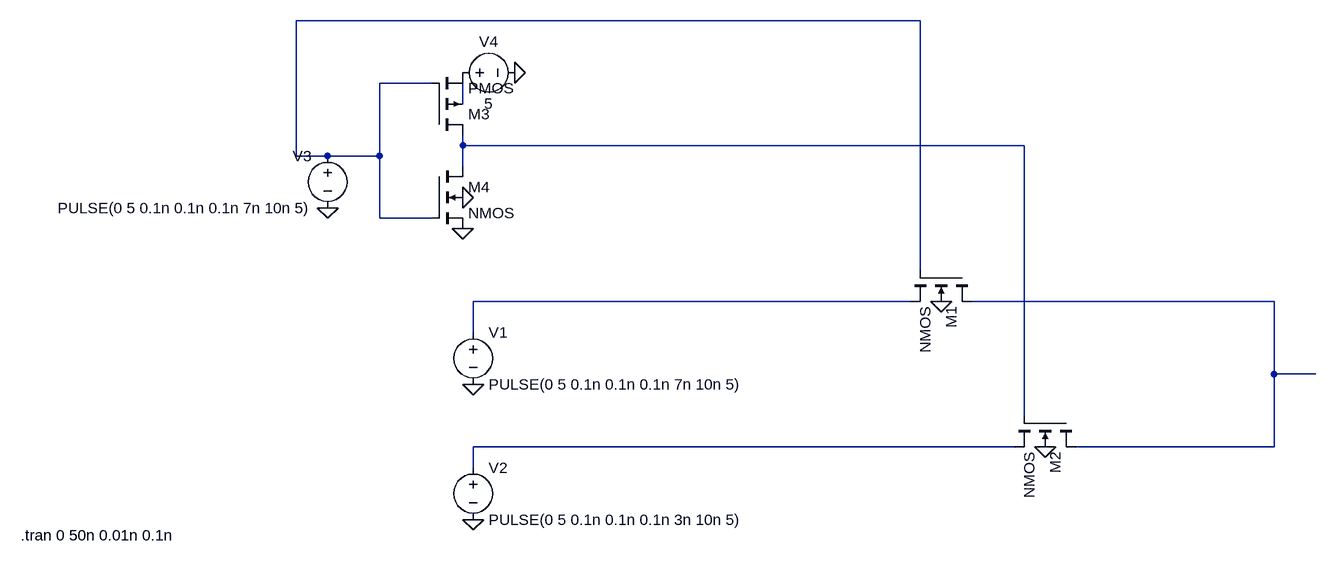
[diagram p0: schematic ptl.asc]
ptl.asc, the LTspice schematic file:
Version 4
SHEET 1 880 680
WIRE 176 -240 -784 -240
WIRE -576 -144 -656 -144
WIRE -528 -112 -528 -144
WIRE -528 -48 -528 -64
WIRE 336 -48 -528 -48
WIRE -784 -32 -784 -240
WIRE -736 -32 -784 -32
WIRE -656 -32 -656 -144
WIRE -656 -32 -736 -32
WIRE -528 -16 -528 -48
WIRE -656 64 -656 -32
WIRE -576 64 -656 64
WIRE 176 144 176 -240
WIRE 160 192 -512 192
WIRE 720 192 256 192
WIRE -512 240 -512 192
WIRE 720 304 720 192
WIRE 784 304 720 304
WIRE 336 368 336 -48
WIRE 320 416 -512 416
WIRE 720 416 720 304
WIRE 720 416 416 416
WIRE -512 448 -512 416
FLAG 208 192 0
FLAG 368 416 0
FLAG -512 528 0
FLAG -512 320 0
FLAG -528 80 0
FLAG -528 32 0
FLAG -448 -160 0
FLAG -736 48 0
SYMBOL voltage -512 224 R0
WINDOW 123 0 0 Left 2
WINDOW 39 0 0 Left 2
SYMATTR InstName V1
SYMATTR Value PULSE(0 5 0.1n 0.1n 0.1n 7n 10n 5)
SYMBOL voltage -512 432 R0
WINDOW 123 0 0 Left 2
WINDOW 39 0 0 Left 2
SYMATTR InstName V2
SYMATTR Value PULSE(0 5 0.1n 0.1n 0.1n 3n 10n 5)
SYMBOL nmos4 256 144 R90
SYMATTR InstName M1
SYMBOL nmos4 416 368 R90
SYMATTR InstName M2
SYMBOL pmos4 -576 -64 M180
SYMATTR InstName M3
SYMBOL nmos4 -576 -16 R0
SYMATTR InstName M4
SYMBOL voltage -544 -160 M90
WINDOW 0 -32 56 VBottom 2
WINDOW 3 32 56 VTop 2
WINDOW 123 0 0 Left 2
WINDOW 39 0 0 Left 2
SYMATTR InstName V4
SYMATTR Value 5
SYMBOL voltage -736 -48 M0
WINDOW 123 0 0 Left 2
WINDOW 39 0 0 Left 2
SYMATTR InstName V3
SYMATTR Value PULSE(0 5 0.1n 0.1n 0.1n 7n 10n 5)
TEXT -1208 552 Left 2 !.tran 0 50n 0.01n 0.1n

The netlist it stands for:
* ptl.asc
V1 N004 0 PULSE(0 5 0.1n 0.1n 0.1n 7n 10n 5)
V2 N006 0 PULSE(0 5 0.1n 0.1n 0.1n 3n 10n 5)
M1 N005 N001 N004 0 NMOS
M2 N005 N003 N006 0 NMOS
M3 N003 N001 P001 N002 PMOS
M4 N003 N001 0 0 NMOS
V4 P001 0 5
V3 N001 0 PULSE(0 5 0.1n 0.1n 0.1n 7n 10n 5)
.model NMOS NMOS
.model PMOS PMOS
.lib standard.mos
.tran 0 50n 0.01n 0.1n
.backanno
.end